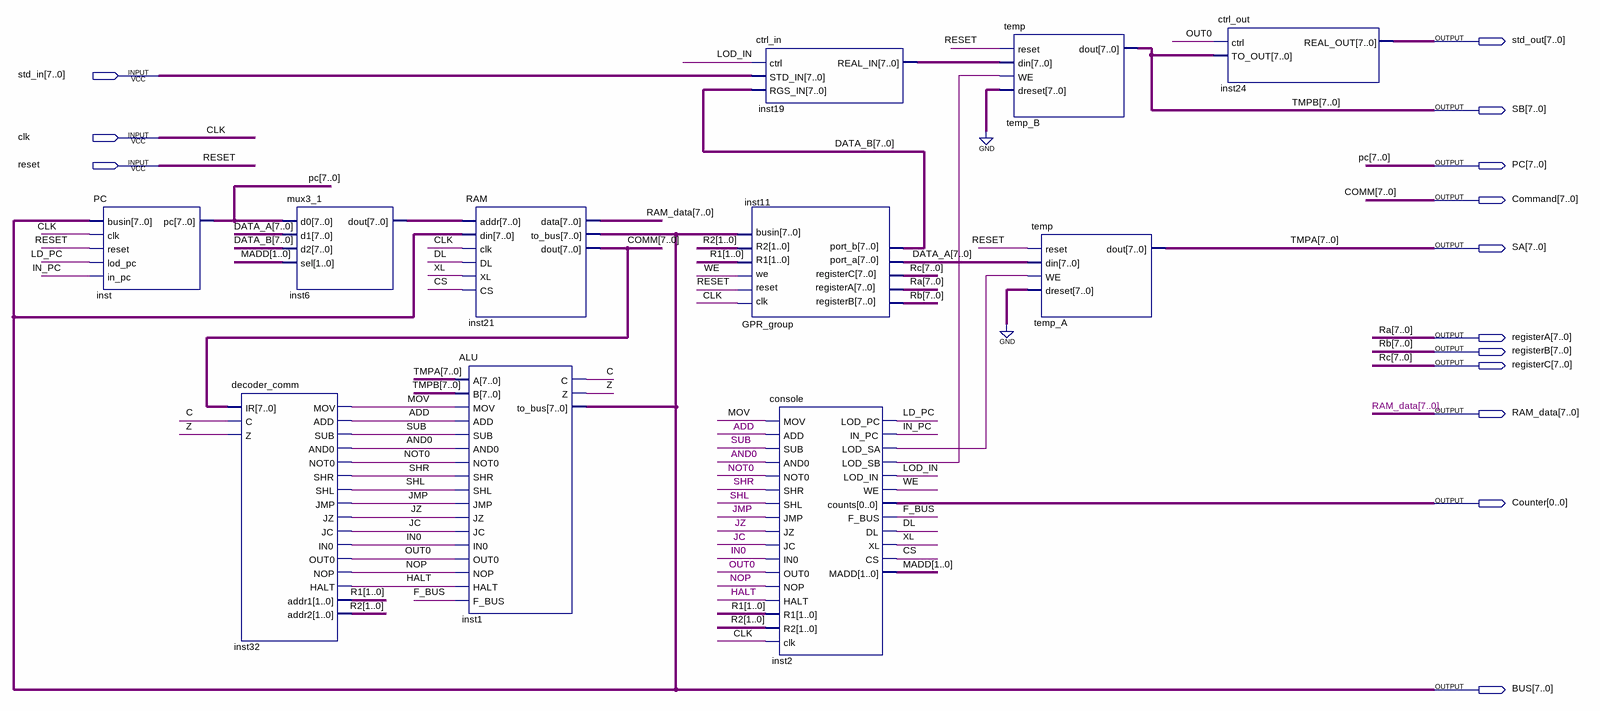
[diagram p0: schematic sheet]
// Quartus schematic CPU_single.bdf as structural Verilog: 11 symbols, 14 pins
module CPU_single (
  input  [7:0] std_in,
  input  clk,
  input  reset,
  output [7:0] std_out,
  output [7:0] SB,
  output [7:0] PC,
  output [7:0] Command,
  output [7:0] SA,
  output [7:0] registerA,
  output [7:0] registerB,
  output [7:0] registerC,
  output [7:0] RAM_data,
  output [0:0] Counter,
  output [7:0] BUS
);

  wire ADD, AND0, C, CS, DL, F_BUS, HALT, IN0, IN_PC, inst2_lod_sa, inst2_lod_sb, JC, JMP, JZ, LD_PC, LOD_IN,
       MOV, NOP, NOT0, OUT0, SHL, SHR, SUB, WE, XL, Z;
  wire [1:0] MADD, R1, R2;
  wire [7:0] DATA_A, DATA_B, inst6_dout, inst19_real_in;

  PC inst (.busin(BUS), .clk(clk), .reset(reset), .lod_pc(LD_PC), .in_pc(IN_PC), .pc(PC));
  decoder_comm inst32 (
    .IR(Command), .C(C), .Z(Z), .MOV(MOV), .ADD(ADD), .SUB(SUB), .AND0(AND0), .NOT0(NOT0), .SHR(SHR),
    .SHL(SHL), .JMP(JMP), .JZ(JZ), .JC(JC), .IN0(IN0), .OUT0(OUT0), .NOP(NOP), .HALT(HALT), .addr1(R1),
    .addr2(R2));
  mux3_1 inst6 (.d0(PC), .d1(DATA_A), .d2(DATA_B), .sel(MADD), .dout(inst6_dout));
  ALU inst1 (
    .A(SA), .B(SB), .MOV(MOV), .ADD(ADD), .SUB(SUB), .AND0(AND0), .NOT0(NOT0), .SHR(SHR), .SHL(SHL),
    .JMP(JMP), .JZ(JZ), .JC(JC), .IN0(IN0), .OUT0(OUT0), .NOP(NOP), .HALT(HALT), .F_BUS(F_BUS), .C(C), .Z(Z),
    .to_bus(BUS));
  RAM inst21 (
    .addr(inst6_dout), .din(BUS), .clk(clk), .DL(DL), .XL(XL), .CS(CS), .data(RAM_data), .to_bus(BUS),
    .dout(Command));
  ctrl_in inst19 (.ctrl(LOD_IN), .STD_IN(std_in), .RGS_IN(DATA_B), .REAL_IN(inst19_real_in));
  GPR_group inst11 (
    .clk(clk), .reset(reset), .we(WE), .R1(R1), .R2(R2), .busin(BUS), .registerB(registerB),
    .registerA(registerA), .registerC(registerC), .port_a(DATA_A), .port_b(DATA_B));
  console inst2 (
    .MOV(MOV), .ADD(ADD), .SUB(SUB), .AND0(AND0), .NOT0(NOT0), .SHR(SHR), .SHL(SHL), .JMP(JMP), .JZ(JZ),
    .JC(JC), .IN0(IN0), .OUT0(OUT0), .NOP(NOP), .HALT(HALT), .R1(R1), .R2(R2), .clk(clk), .LOD_PC(LD_PC),
    .IN_PC(IN_PC), .LOD_SA(inst2_lod_sa), .LOD_SB(inst2_lod_sb), .LOD_IN(LOD_IN), .WE(WE),
    .counts(Counter[0]), .F_BUS(F_BUS), .DL(DL), .XL(XL), .CS(CS), .MADD(MADD));
  temp temp_B (.reset(reset), .din(inst19_real_in), .WE(inst2_lod_sb), .dreset({8{1'b0}}), .dout(SB));
  temp temp_A (.reset(reset), .din(DATA_A), .WE(inst2_lod_sa), .dreset({8{1'b0}}), .dout(SA));
  ctrl_out inst24 (.ctrl(OUT0), .TO_OUT(SB), .REAL_OUT(std_out));

  // Other names for the same wires on the sheet: COMM[7:0] = Command; Ra[7:0] = registerA; Rb[7:0] = registerB;
  //   Rc[7:0] = registerC; TMPA[7:0] = SA; TMPB[7:0] = SB

  // Notes on the sheet:
  //   RAM_data[7..0]
  //   ADD
  //   SUB
  //   AND0
  //   NOT0
  //   SHR
  //   SHL
  //   JMP
  //   JZ
  //   JC
  //   IN0
  //   OUT0
  //   NOP
  //   HALT
endmodule
